# Altium schematic sheet Sheet1.SchDoc
size A4
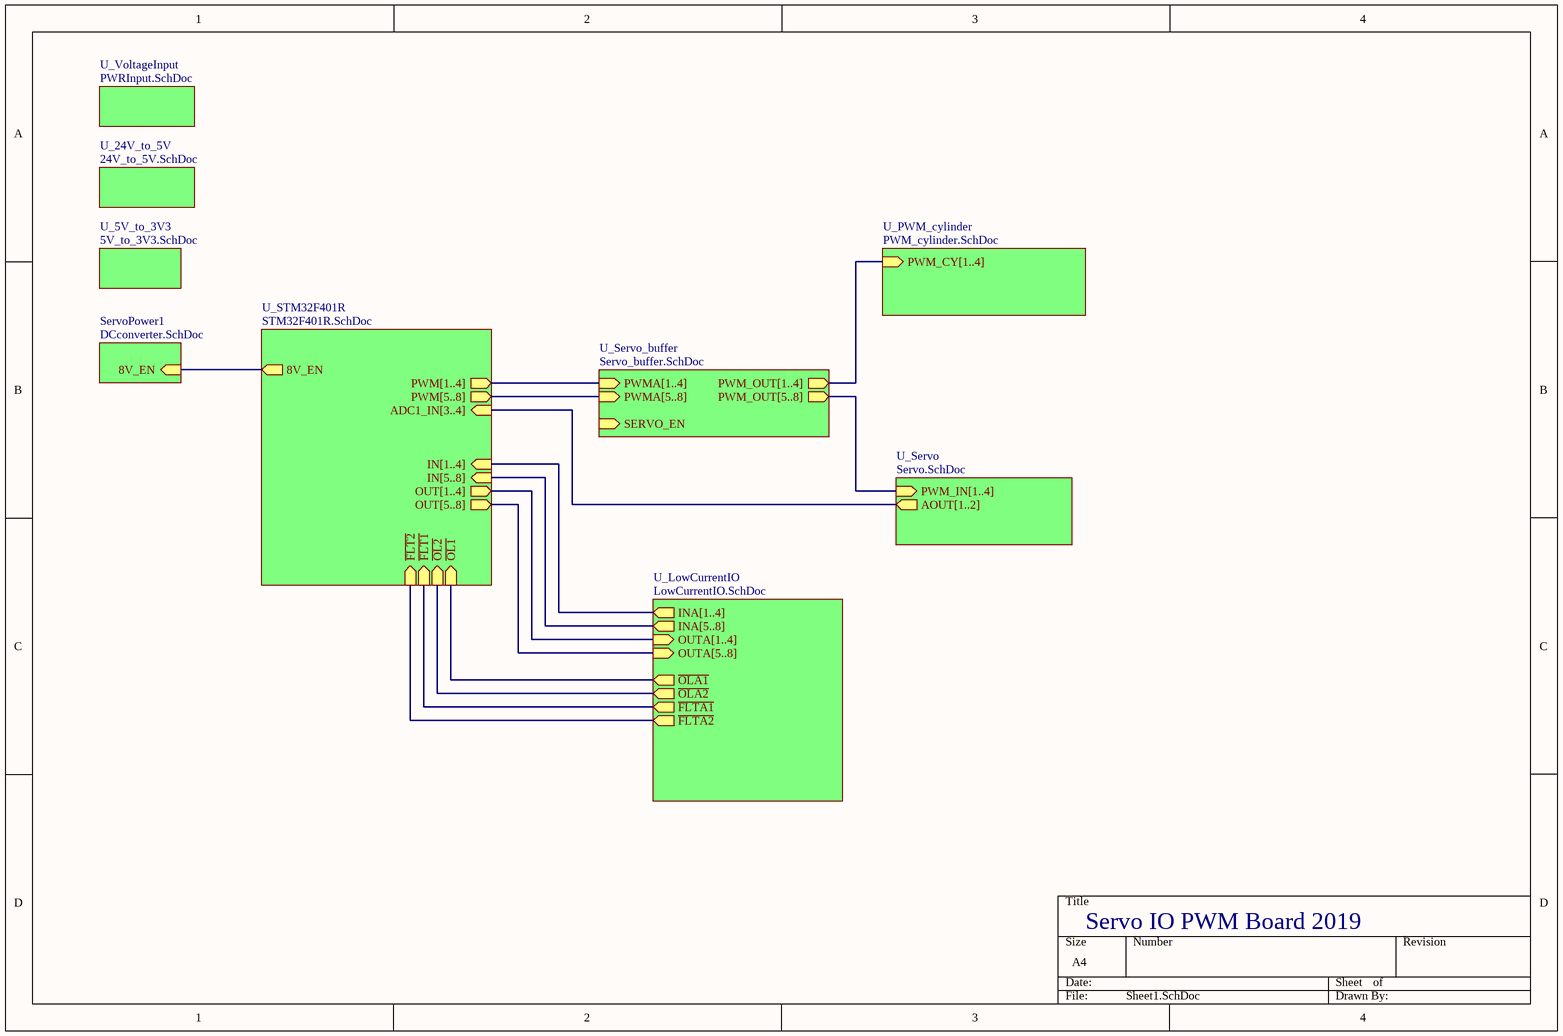
[diagram p0: Sheet1.SchDoc]

## Sub-sheets
ServoPower1 = DCconverter.SchDoc: 8V_EN (in)
U_5V_to_3V3 = 5V_to_3V3.SchDoc: no entries
U_24V_to_5V = 24V_to_5V.SchDoc: no entries
U_LowCurrentIO = LowCurrentIO.SchDoc: ~{OLA2} (out), ~{FLTA1} (out), ~{FLTA2} (out), ~{OLA1} (out), INA[5..8] (out), OUTA[5..8] (in), INA[1..4] (out), OUTA[1..4] (in)
U_PWM_cylinder = PWM_cylinder.SchDoc: PWM_CY[1..4] (in)
U_Servo = Servo.SchDoc: PWM_IN[1..4] (in), AOUT[1..2] (out)
U_Servo_buffer = Servo_buffer.SchDoc: SERVO_EN (in), PWMA[5..8] (in), PWMA[1..4] (in), PWM_OUT[5..8] (out), PWM_OUT[1..4] (out)
U_STM32F401R = STM32F401R.SchDoc: ~{OL2} (in), ~{FLT1} (in), ~{FLT2} (in), ~{OL1} (in), 8V_EN (out), IN[5..8] (in), ADC1_IN[3..4] (in), PWM[1..4] (out), PWM[5..8] (out), IN[1..4] (in), OUT[1..4] (out), OUT[5..8] (out)
U_VoltageInput = PWRInput.SchDoc: no entries

## Nets
(unnamed): sheet ServoPower1/8V_EN, sheet U_STM32F401R/8V_EN
(unnamed): sheet U_STM32F401R/~{OL2}, sheet U_LowCurrentIO/~{OLA2}
(unnamed): sheet U_STM32F401R/~{FLT1}, sheet U_LowCurrentIO/~{FLTA1}
(unnamed): sheet U_STM32F401R/~{FLT2}, sheet U_LowCurrentIO/~{FLTA2}
(unnamed): sheet U_STM32F401R/~{OL1}, sheet U_LowCurrentIO/~{OLA1}

## Buses and harness runs
bus sheet U_LowCurrentIO/INA[1..4] = sheet U_STM32F401R/IN[1..4]
bus sheet U_LowCurrentIO/INA[5..8] = sheet U_STM32F401R/IN[5..8]
bus sheet U_LowCurrentIO/OUTA[1..4] = sheet U_STM32F401R/OUT[1..4]
bus sheet U_LowCurrentIO/OUTA[5..8] = sheet U_STM32F401R/OUT[5..8]
bus sheet U_PWM_cylinder/PWM_CY[1..4] = sheet U_Servo_buffer/PWM_OUT[1..4]
bus sheet U_Servo/AOUT[1..2] = sheet U_STM32F401R/ADC1_IN[3..4]
bus sheet U_Servo/PWM_IN[1..4] = sheet U_Servo_buffer/PWM_OUT[5..8]
bus sheet U_Servo_buffer/PWMA[1..4] = sheet U_STM32F401R/PWM[1..4]
bus sheet U_Servo_buffer/PWMA[5..8] = sheet U_STM32F401R/PWM[5..8]

## Notes on the sheet
- Servo IO PWM Board 2019